# EAGLE design encoder (EAGLE 7.7.0)
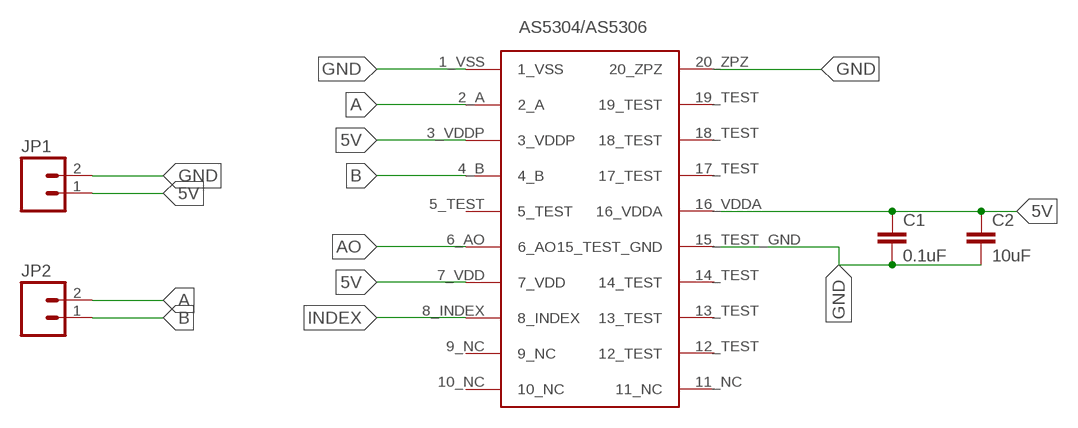
[diagram p0: schematic, sheet 1]

## Parts
C1  0.1uF  C-EUC0603  [C0603]
C2  10uF  C-EUC0603  [C0603]
JP1  M02LOCK  [1X02_LOCK]
JP2  M02LOCK  [1X02_LOCK]
U$1  AS5304/AS5306-ENCODER  [AS5304/AS5306-ENCODER]

## Nets
5V: C1.1 C2.1 JP1.1 U$1.3_VDDP U$1.7_VDD U$1.16_VDDA
A: JP2.2 U$1.2_A
AO: U$1.6_AO
B: JP2.1 U$1.4_B
GND: C1.2 C2.2 JP1.2 U$1.1_VSS U$1.15_TEST_GND U$1.20_ZPZ
INDEX: U$1.8_INDEX
Unconnected: U$1.5_TEST U$1.9_NC U$1.10_NC U$1.11_NC U$1.12_TEST U$1.13_TEST U$1.14_TEST U$1.17_TEST U$1.18_TEST U$1.19_TEST

## Library data of the parts
C1 C2 = rcl:C-EU: CAPACITOR, European symbol
JP1 JP2 = SparkFun:M02: Header 2 Standard 2-pin 0.1" header. Use with straight break away headers (SKU : PRT-00116), right angle break away headers (PRT-00553), swiss pins (PRT-00743), machine pins (PRT-00117), and female headers (PRT-00115). Molex polarized connector foot print use with SKU : PRT-08233 with associated crimp pins and housings.
U$1 = AS5304_AS5306-Encoder:AS5304/AS5306-ENCODER

## Board
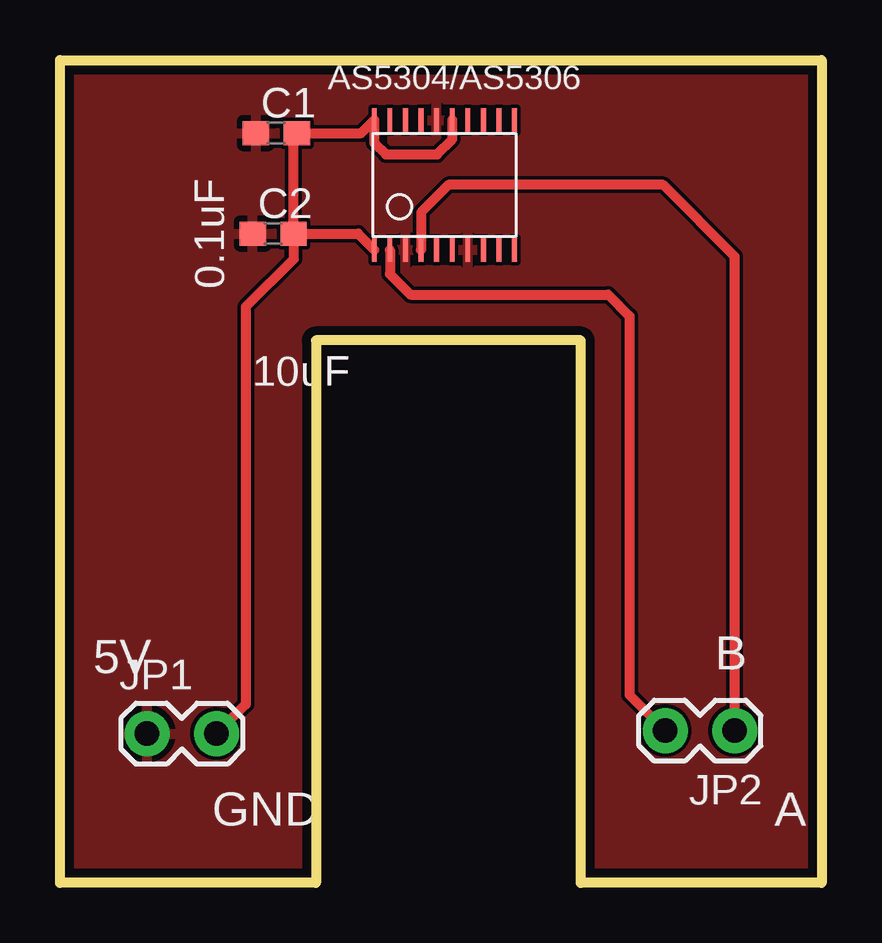
[diagram p1: board, top side]
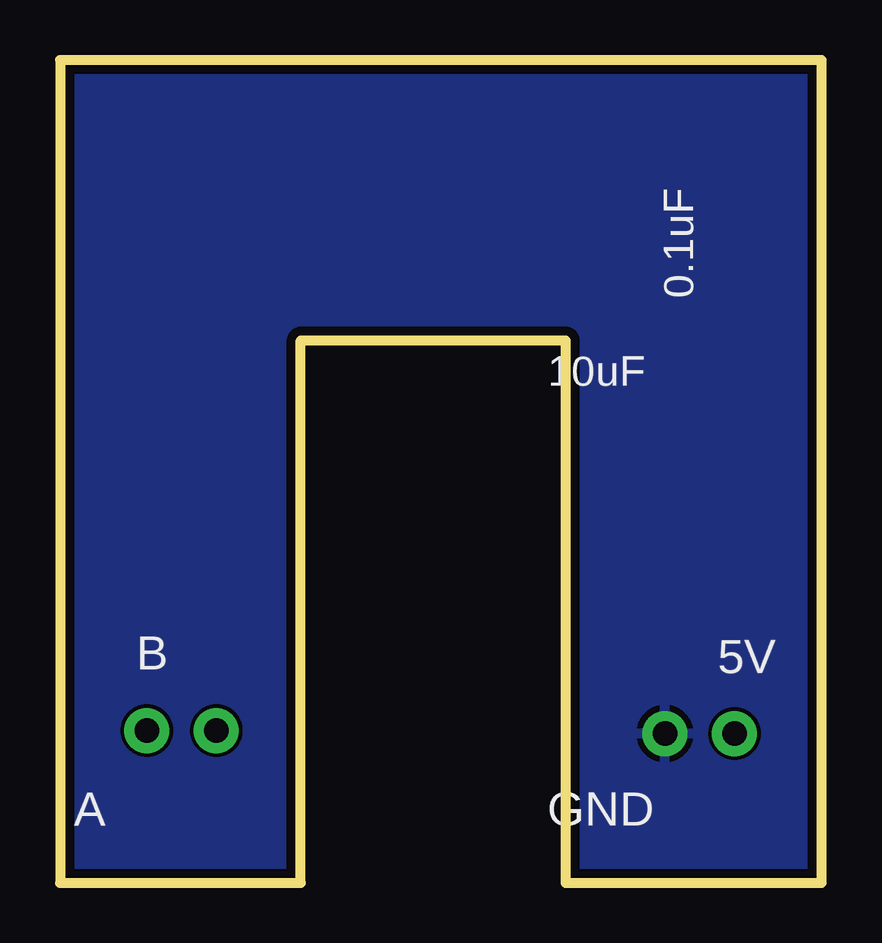
[diagram p2: board, bottom side, seen from below]

Size 31.75 x 34.29 mm. Coordinates in mm from the lower left corner, seen from the top.
Outline: 0,34.29 31.75,34.29 31.75,0 21.72,0 21.72,22.61 10.67,22.61 10.67,0 0,0 0,34.29
Copper layers (1*16): Top 0.0356mm / dielectric 1.5011mm / Bottom 0.0356mm
Design rules "LaenPCBOrder": minimum track width 6mil, minimum drill 13mil, track to track 6mil, track to pad 6mil, pad to pad 6mil, via to via 6mil, smd to smd 6mil, copper to edge 15mil, drill to drill 6mil, minimum pad ring 7mil, minimum via ring 7mil, stop-mask expansion 3mil, vias tented up to drill 0mil, thermal gap 10mil

### Footprints (pad centres in the part's own frame; a part is rotated, then mirrored left to right if it is on the bottom)
C0603 = smd 1.1 x 1: 1 -0.85,0; 2 0.85,0
1X02_LOCK = drill 1.016 pad 1.88: 1 -0.178,0; 2 2.718,0
AS5304/AS5306-ENCODER = smd 0.2 x 1: 1_VSS -2.9,-2.7; 2_A -2.25,-2.7; 3_VDDP -1.6,-2.7; 4_B -0.95,-2.7; 5_TEST -0.3,-2.7; 6_AO 0.35,-2.7; 7_VDD 1,-2.7; 8_INDEX 1.65,-2.7; 9_NC 2.3,-2.7; 10_NC 2.95,-2.7; 11_NC 2.95,2.7; 12_TEST 2.3,2.7; 13_TEST 1.65,2.7; 14_TEST 1,2.7; 15_TEST_GND 0.35,2.7; 16_VDDA -0.3,2.7; 17_TEST -0.95,2.7; 18_TEST -1.6,2.7; 19_TEST -2.25,2.7; 20_ZPZ -2.9,2.7

### Placement (x,y rotation side)
C1  9.02,31.24 0 top
C2  8.89,27.05 0 top
JP1  3.81,6.22 0 top
JP2  27.95,6.35 180 top
U$1  16,29.08 0 top

### Tracks (layer width: path | path; a pad name or v marks a point on that pad's centre or on a via)
5V
  pour Top: 0,34.29 31.75,34.29 31.75,0 21.72,0 21.72,22.61 10.67,22.61 10.67,0 0,0
A
  Top 0.406: U$1.2_A 13.75,25.36 14.61,24.51 22.86,24.51 23.75,23.62 23.75,7.84 JP2.2
B
  Top 0.406: JP2.1 28.13,26.1 25.15,29.08 16.2,29.08 15.06,27.94 15.06,26.39 U$1.4_B
GND
  Top 0.406: U$1.15_TEST_GND 16.36,30.99 15.72,30.35 13.59,30.35 13.1,30.84 U$1.20_ZPZ 12.56,31.24 C1.2 9.74,31.11 C2.2 | C2.2 12.43,27.05 U$1.1_VSS | C2.2 9.74,26 7.75,24 7.75,7.44 JP1.2
  pour Bottom: 0,34.29 31.75,34.29 31.75,0 21.72,0 21.72,22.61 10.67,22.61 10.67,0 0,0

### Text on the board
tPlace: 0.1uF | 10uF | 5V | B | GND | A
bPlace: 0.1uF | 10uF | 5V | B | GND | A